# Altium schematic sheet p06_led_config_button.SchDoc
size 386 x 246 mm
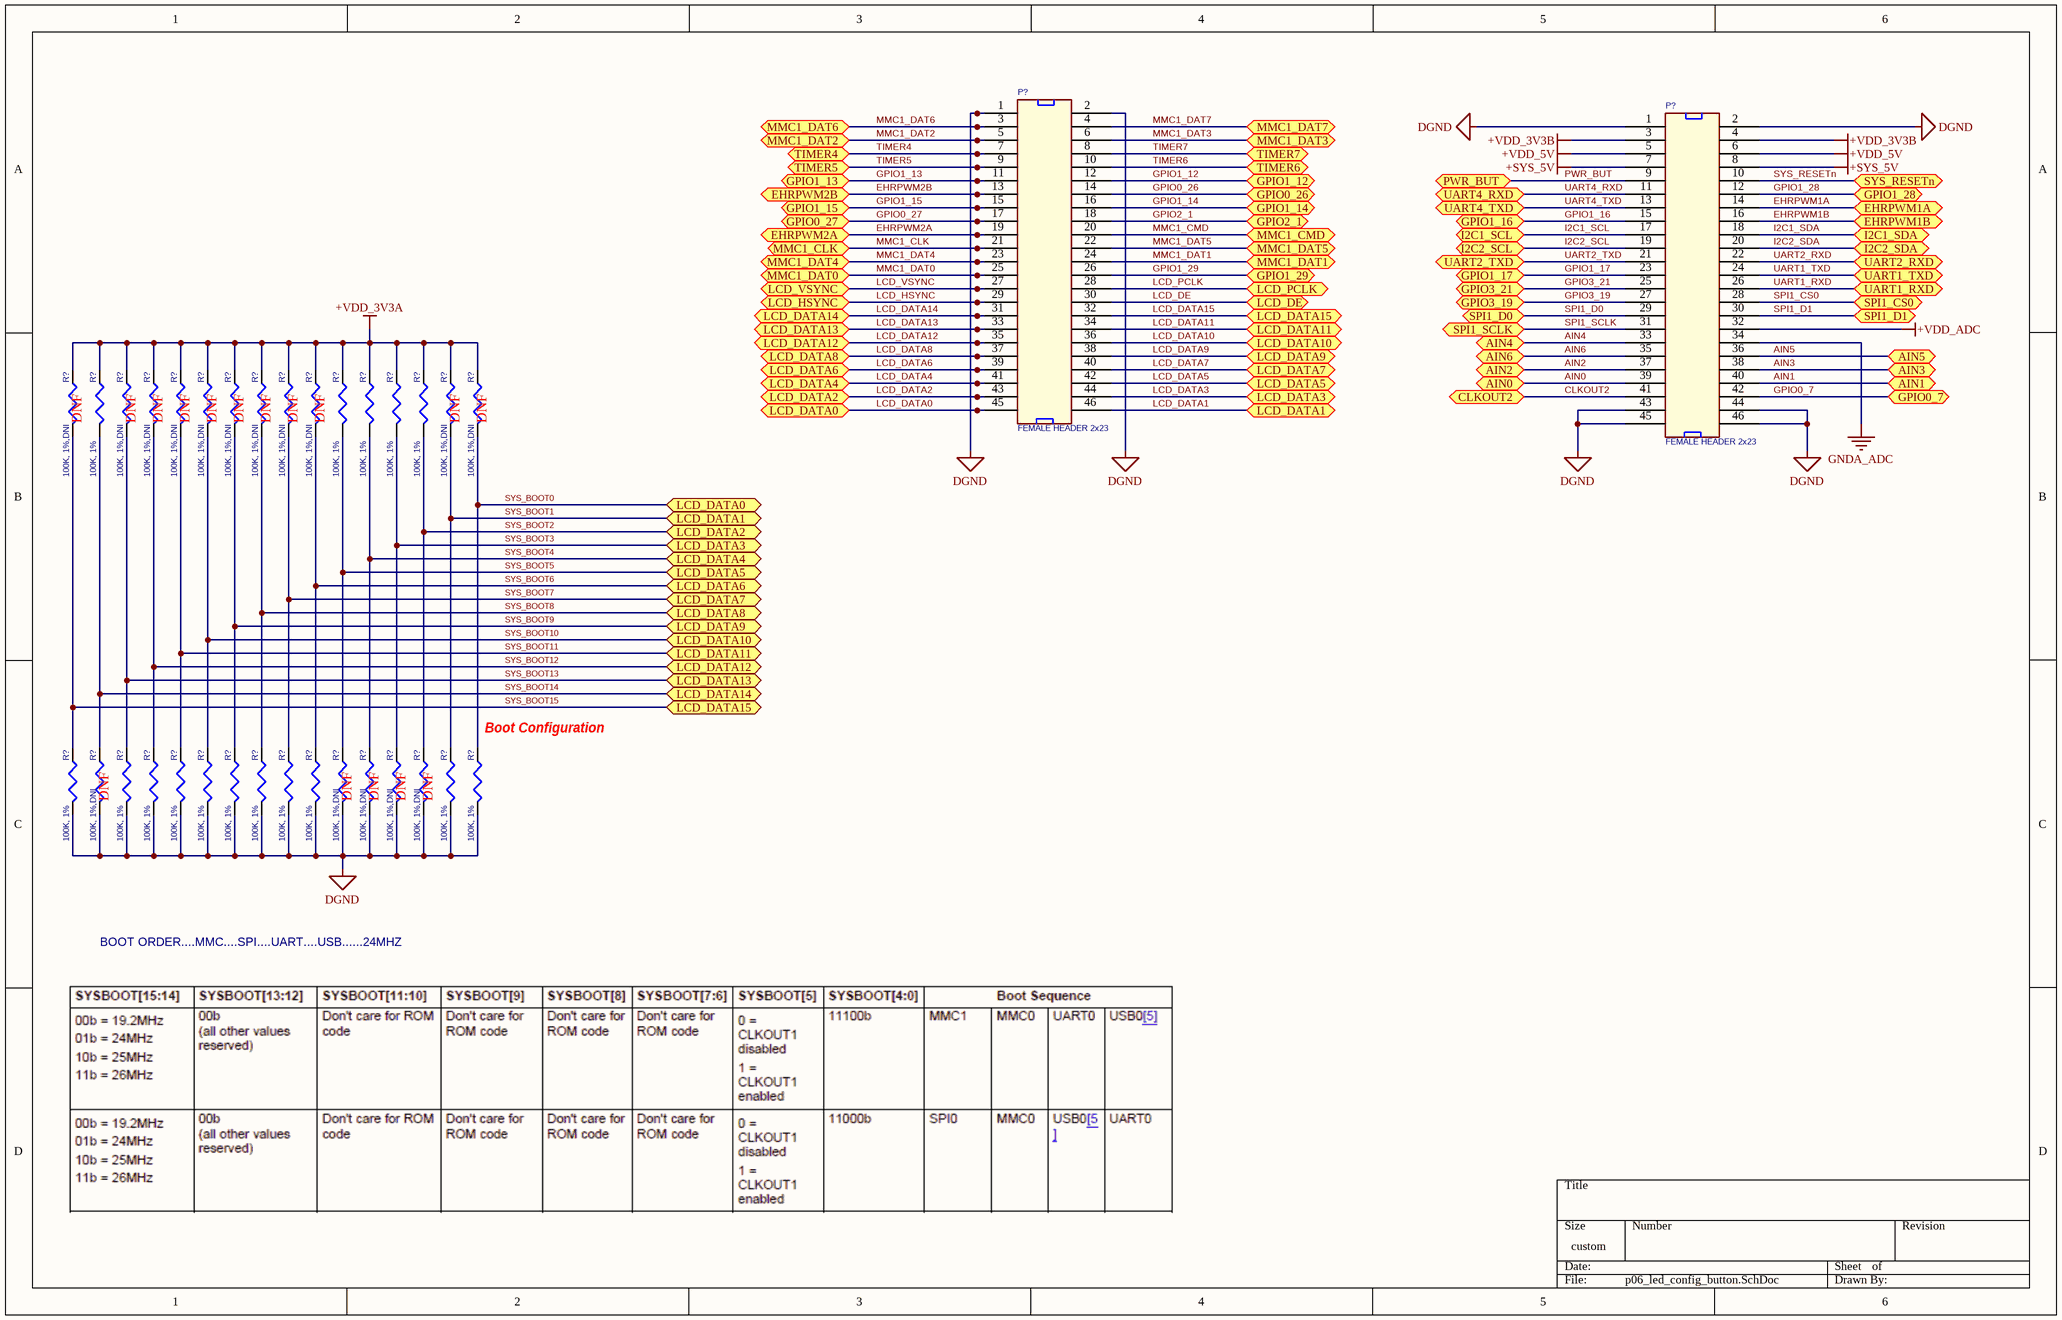
[diagram p0: p06_led_config_button.SchDoc]

## Parts
(Parts that share a designator on the sheet are numbered #1, #2 ... from top to bottom, then left to right.)
P?#1  FEMALE HEADER 2x23  [HEADER23X2]
P?#2  FEMALE HEADER 2x23  [HEADER23X2]
R?#1  100K, 1%,DNI  [402]
R?#2  100K, 1%  [402]
R?#3  100K, 1%,DNI  [402]
R?#4  100K, 1%,DNI  [402]
R?#5  100K, 1%,DNI  [402]
R?#6  100K, 1%,DNI  [402]
R?#7  100K, 1%,DNI  [402]
R?#8  100K, 1%,DNI  [402]
R?#9  100K, 1%,DNI  [402]
R?#10  100K, 1%,DNI  [402]
R?#11  100K, 1%  [402]
R?#12  100K, 1%  [402]
R?#13  100K, 1%  [402]
R?#14  100K, 1%  [402]
R?#15  100K, 1%,DNI  [402]
R?#16  100K, 1%,DNI  [402]
R?#17  100K, 1%  [402]
R?#18  100K, 1%,DNI  [402]
R?#19  100K, 1%  [402]
R?#20  100K, 1%  [402]
R?#21  100K, 1%  [402]
R?#22  100K, 1%  [402]
R?#23  100K, 1%  [402]
R?#24  100K, 1%  [402]
R?#25  100K, 1%  [402]
R?#26  100K, 1%  [402]
R?#27  100K, 1%,DNI  [402]
R?#28  100K, 1%,DNI  [402]
R?#29  100K, 1%,DNI  [402]
R?#30  100K, 1%,DNI  [402]
R?#31  100K, 1%  [402]
R?#32  100K, 1%  [402]

## Ports
AIN0, AIN1, AIN2, AIN3, AIN4, AIN5, AIN6, CLKOUT2, EHRPWM1A, EHRPWM1B, EHRPWM2A, EHRPWM2B, GPIO0_7, GPIO0_26, GPIO0_27, GPIO1_12, GPIO1_13, GPIO1_14, GPIO1_15, GPIO1_16, GPIO1_17, GPIO1_28, GPIO1_29, GPIO2_1, GPIO3_19, GPIO3_21, I2C1_SCL, I2C1_SDA, I2C2_SCL, I2C2_SDA, LCD_DATA0, LCD_DATA1, LCD_DATA2, LCD_DATA3, LCD_DATA4, LCD_DATA5, LCD_DATA6, LCD_DATA7, LCD_DATA8, LCD_DATA9, LCD_DATA10, LCD_DATA11, LCD_DATA12, LCD_DATA13, LCD_DATA14, LCD_DATA15, LCD_DE, LCD_HSYNC, LCD_PCLK, LCD_VSYNC, MMC1_CLK, MMC1_CMD, MMC1_DAT0, MMC1_DAT1, MMC1_DAT2, MMC1_DAT3, MMC1_DAT4, MMC1_DAT5, MMC1_DAT6, MMC1_DAT7, PWR_BUT, SPI1_CS0, SPI1_D0, SPI1_D1, SPI1_SCLK, SYS_RESETn, TIMER4, TIMER5, TIMER6, TIMER7, UART1_RXD, UART1_TXD, UART2_RXD, UART2_TXD, UART4_RXD, UART4_TXD

## Nets
+SYS_5V: P?#2.7 P?#2.8
+VDD_3V3A: R?#1.1 R?#2.1 R?#3.1 R?#4.1 R?#5.1 R?#6.1 R?#7.1 R?#8.1 R?#9.1 R?#10.1 R?#11.1 R?#12.1 R?#13.1 R?#14.1 R?#15.1 R?#16.1
+VDD_3V3B: P?#2.3 P?#2.4
+VDD_5V: P?#2.5 P?#2.6
+VDD_ADC: P?#2.32
DGND: P?#1.1 P?#1.2 P?#2.1 P?#2.2 P?#2.43 P?#2.44 P?#2.45 P?#2.46 R?#17.2 R?#18.2 R?#19.2 R?#20.2 R?#21.2 R?#22.2 R?#23.2 R?#24.2 R?#25.2 R?#26.2 R?#27.2 R?#28.2 R?#29.2 R?#30.2 R?#31.2 R?#32.2
GNDA_ADC: P?#2.34
AIN0: P?#2.39 ; port AIN0
AIN1: P?#2.40 ; port AIN1
AIN2: P?#2.37 ; port AIN2
AIN3: P?#2.38 ; port AIN3
AIN4: P?#2.33 ; port AIN4
AIN5: P?#2.36 ; port AIN5
AIN6: P?#2.35 ; port AIN6
CLKOUT2: P?#2.41 ; port CLKOUT2
EHRPWM1A: P?#2.14 ; port EHRPWM1A
EHRPWM1B: P?#2.16 ; port EHRPWM1B
EHRPWM2A: P?#1.19 ; port EHRPWM2A
EHRPWM2B: P?#1.13 ; port EHRPWM2B
GPIO0_7: P?#2.42 ; port GPIO0_7
GPIO0_26: P?#1.14 ; port GPIO0_26
GPIO0_27: P?#1.17 ; port GPIO0_27
GPIO1_12: P?#1.12 ; port GPIO1_12
GPIO1_13: P?#1.11 ; port GPIO1_13
GPIO1_14: P?#1.16 ; port GPIO1_14
GPIO1_15: P?#1.15 ; port GPIO1_15
GPIO1_16: P?#2.15 ; port GPIO1_16
GPIO1_17: P?#2.23 ; port GPIO1_17
GPIO1_28: P?#2.12 ; port GPIO1_28
GPIO1_29: P?#1.26 ; port GPIO1_29
GPIO2_1: P?#1.18 ; port GPIO2_1
GPIO3_19: P?#2.27 ; port GPIO3_19
GPIO3_21: P?#2.25 ; port GPIO3_21
I2C1_SCL: P?#2.17 ; port I2C1_SCL
I2C1_SDA: P?#2.18 ; port I2C1_SDA
I2C2_SCL: P?#2.19 ; port I2C2_SCL
I2C2_SDA: P?#2.20 ; port I2C2_SDA
LCD_DATA0: P?#1.45 R?#16.2 R?#32.1 ; port LCD_DATA0  [also labelled SYS_BOOT0]
LCD_DATA1: P?#1.46 R?#15.2 R?#31.1 ; port LCD_DATA1  [also labelled SYS_BOOT1]
LCD_DATA2: P?#1.43 R?#14.2 R?#30.1 ; port LCD_DATA2  [also labelled SYS_BOOT2]
LCD_DATA3: P?#1.44 R?#13.2 R?#29.1 ; port LCD_DATA3  [also labelled SYS_BOOT3]
LCD_DATA4: P?#1.41 R?#12.2 R?#28.1 ; port LCD_DATA4  [also labelled SYS_BOOT4]
LCD_DATA5: P?#1.42 R?#11.2 R?#27.1 ; port LCD_DATA5  [also labelled SYS_BOOT5]
LCD_DATA6: P?#1.39 R?#10.2 R?#26.1 ; port LCD_DATA6  [also labelled SYS_BOOT6]
LCD_DATA7: P?#1.40 R?#9.2 R?#25.1 ; port LCD_DATA7  [also labelled SYS_BOOT7]
LCD_DATA8: P?#1.37 R?#8.2 R?#24.1 ; port LCD_DATA8  [also labelled SYS_BOOT8]
LCD_DATA9: P?#1.38 R?#7.2 R?#23.1 ; port LCD_DATA9  [also labelled SYS_BOOT9]
LCD_DATA10: P?#1.36 R?#6.2 R?#22.1 ; port LCD_DATA10  [also labelled SYS_BOOT10]
LCD_DATA11: P?#1.34 R?#5.2 R?#21.1 ; port LCD_DATA11  [also labelled SYS_BOOT11]
LCD_DATA12: P?#1.35 R?#4.2 R?#20.1 ; port LCD_DATA12  [also labelled SYS_BOOT12]
LCD_DATA13: P?#1.33 R?#3.2 R?#19.1 ; port LCD_DATA13  [also labelled SYS_BOOT13]
LCD_DATA14: P?#1.31 R?#2.2 R?#18.1 ; port LCD_DATA14  [also labelled SYS_BOOT14]
LCD_DATA15: P?#1.32 R?#1.2 R?#17.1 ; port LCD_DATA15  [also labelled SYS_BOOT15]
LCD_DE: P?#1.30 ; port LCD_DE
LCD_HSYNC: P?#1.29 ; port LCD_HSYNC
LCD_PCLK: P?#1.28 ; port LCD_PCLK
LCD_VSYNC: P?#1.27 ; port LCD_VSYNC
MMC1_CLK: P?#1.21 ; port MMC1_CLK
MMC1_CMD: P?#1.20 ; port MMC1_CMD
MMC1_DAT0: P?#1.25 ; port MMC1_DAT0
MMC1_DAT1: P?#1.24 ; port MMC1_DAT1
MMC1_DAT2: P?#1.5 ; port MMC1_DAT2
MMC1_DAT3: P?#1.6 ; port MMC1_DAT3
MMC1_DAT4: P?#1.23 ; port MMC1_DAT4
MMC1_DAT5: P?#1.22 ; port MMC1_DAT5
MMC1_DAT6: P?#1.3 ; port MMC1_DAT6
MMC1_DAT7: P?#1.4 ; port MMC1_DAT7
PWR_BUT: P?#2.9 ; port PWR_BUT
SPI1_CS0: P?#2.28 ; port SPI1_CS0
SPI1_D0: P?#2.29 ; port SPI1_D0
SPI1_D1: P?#2.30 ; port SPI1_D1
SPI1_SCLK: P?#2.31 ; port SPI1_SCLK
SYS_RESETn: P?#2.10 ; port SYS_RESETn
TIMER4: P?#1.7 ; port TIMER4
TIMER5: P?#1.9 ; port TIMER5
TIMER6: P?#1.10 ; port TIMER6
TIMER7: P?#1.8 ; port TIMER7
UART1_RXD: P?#2.26 ; port UART1_RXD
UART1_TXD: P?#2.24 ; port UART1_TXD
UART2_RXD: P?#2.22 ; port UART2_RXD
UART2_TXD: P?#2.21 ; port UART2_TXD
UART4_RXD: P?#2.11 ; port UART4_RXD
UART4_TXD: P?#2.13 ; port UART4_TXD

## Notes on the sheet
- (near R?#1) DNF
- (near R?#3) DNF
- (near R?#4) DNF
- (near R?#5) DNF
- (near R?#6) DNF
- (near R?#7) DNF
- (near R?#8) DNF
- (near R?#9) DNF
- (near R?#10) DNF
- (near R?#15) DNF
- (near R?#16) DNF
- (near R?#32) Boot Configuration
- (near R?#18) DNF
- (near R?#27) DNF
- (near R?#28) DNF
- (near R?#29) DNF
- (near R?#30) DNF
- BOOT ORDER....MMC....SPI....UART....USB......24MHZ

## Library data of the parts
P?#1 P?#2 = HDR_46_F_2_0.1_0.1: CONN HEADER FMAL 46PS.1" DL GOLD; Manufacturer: Sullins Connector Solutions; Manufacturer Part Number: PPPC232LFBN-RC; Number of Positions: 46; Number of Positions Loaded: All; Pitch: 0.100" (2.54mm); Supplier 1: Digi-Key; Supplier Part Number 1: S7126-ND; RoHS: RoHS Compliant; Category: Connectors, Interconnects; Stock 1: 750; Pricing 1: 1=2.75, 10=2.325, 25=2.2196, 50=2.0084, 100=1.7969, 250=1.58552, 500=1.4798, 1000=1.3741, 2500=1.32125 (USD); Connector Type: Header; Contact Type: Female Socket; Number of Rows: 2; Row Spacing: 0.100" (2.54mm); Mounting Type: Through Hole; Termination: Solder; Fastening Type: -; Features: -; Contact Finish: Gold; Contact Finish Thickness: Flash; Color: Black; Packaging: Bulk; ComponentLink1URL: http://www.sullinscorp.com/drawings/78_P(N)PxCxxxLFBN-RC,_10492-G.pdf; ComponentLink1Description: http://www.sullinscorp.com/drawings/78_P(N)PxCxxxLFBN-RC,_10492-G.pdf
R?#1-R?#32 = RES_100K_1/16W_1%_0402: RES 100K OHM 1/16W 1% 0402 SMD; Manufacturer: Stackpole Electronics Inc; Manufacturer Part Number: RMCF0402FT100K; Power (Watts): 0.063W, 1/16W; Temperature Coefficient: ±100ppm/°C; Category: Resistors; ComponentLink1Description: http://www.seielect.com/Catalog/SEI-RMCF_RMCP.pdf; ComponentLink1URL: http://www.seielect.com/Catalog/SEI-RMCF_RMCP.pdf; Composition: Thick Film; Features: -; Height: 0.016" (0.40mm); Number of Terminations: 2; Package / Case: 0402 (1005 Metric); Packaging: Digi-Reel®; Pricing 1: 1=0.04, 10=0.025, 50=0.0138, 100=0.0105, 250=0.0078, 500=0.00576, 1000=0.00384, 2500=0.00324, 5000=0.0027 (USD); Resistance (Ohms): 100k; RoHS: RoHS Compliant; Size / Dimension: 0.039" L x 0.020" W (1.00mm x 0.50mm); Stock 1: 851196; Supplier 1: Digi-Key; Supplier Device Package: 0402; Supplier Part Number 1: RMCF0402FT100KDKR-ND; Tolerance: ±1%